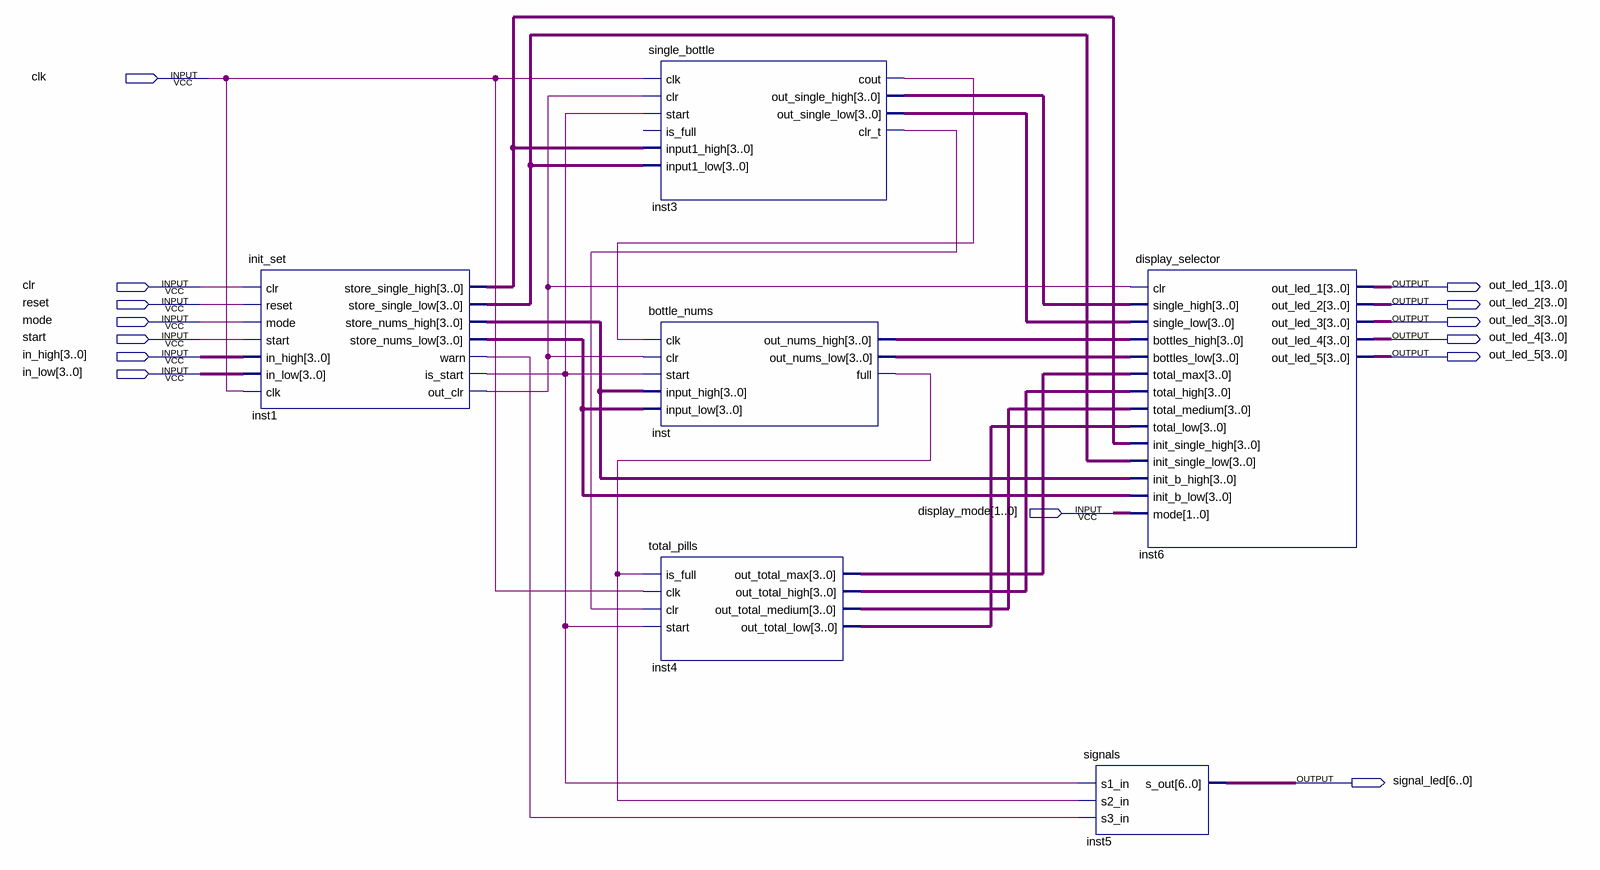
[diagram p0: schematic sheet]
// Quartus schematic pill_bottle.bdf as structural Verilog: 6 symbols, 14 pins
module pill_bottle (
  input  clk,
  input  clr,
  input  reset,
  input  mode,
  input  start,
  input  [3:0] in_high,
  input  [3:0] in_low,
  input  [1:0] display_mode,
  output [3:0] out_led_1,
  output [3:0] out_led_2,
  output [3:0] out_led_3,
  output [3:0] out_led_4,
  output [3:0] out_led_5,
  output [6:0] signal_led
);

  wire inst1_is_start, inst1_out_clr, inst1_warn, inst3_clr_t, inst3_cout, inst_full;
  wire [3:0] inst1_store_nums_high, inst1_store_nums_low, inst1_store_single_high, inst1_store_single_low,
       inst3_out_single_high, inst3_out_single_low, inst4_out_total_high, inst4_out_total_low,
       inst4_out_total_max, inst4_out_total_medium, inst_out_nums_high, inst_out_nums_low;

  init_set inst1 (
    .clr(clr), .reset(reset), .mode(mode), .start(start), .in_high(in_high), .in_low(in_low), .clk(clk),
    .store_single_high(inst1_store_single_high), .store_single_low(inst1_store_single_low),
    .store_nums_high(inst1_store_nums_high), .store_nums_low(inst1_store_nums_low), .warn(inst1_warn),
    .is_start(inst1_is_start), .out_clr(inst1_out_clr));
  single_bottle inst3 (
    .clk(clk), .clr(inst1_out_clr), .start(inst1_is_start), .input1_high(inst1_store_single_high),
    .input1_low(inst1_store_single_low), .cout(inst3_cout), .out_single_high(inst3_out_single_high),
    .out_single_low(inst3_out_single_low), .clr_t(inst3_clr_t));  // open: is_full
  bottle_nums inst (
    .clk(inst3_cout), .clr(inst1_out_clr), .start(inst1_is_start), .input_high(inst1_store_nums_high),
    .input_low(inst1_store_nums_low), .out_nums_high(inst_out_nums_high), .out_nums_low(inst_out_nums_low),
    .full(inst_full));
  total_pills inst4 (
    .is_full(inst_full), .clk(clk), .clr(inst3_clr_t), .start(inst1_is_start),
    .out_total_max(inst4_out_total_max), .out_total_high(inst4_out_total_high),
    .out_total_medium(inst4_out_total_medium), .out_total_low(inst4_out_total_low));
  signals inst5 (.s1_in(inst1_is_start), .s2_in(inst_full), .s3_in(inst1_warn), .s_out(signal_led));
  display_selector inst6 (
    .clr(inst1_out_clr), .single_high(inst3_out_single_high), .single_low(inst3_out_single_low),
    .bottles_high(inst_out_nums_high), .bottles_low(inst_out_nums_low), .total_max(inst4_out_total_max),
    .total_high(inst4_out_total_high), .total_medium(inst4_out_total_medium),
    .total_low(inst4_out_total_low), .init_single_high(inst1_store_single_high),
    .init_single_low(inst1_store_single_low), .init_b_high(inst1_store_nums_high),
    .init_b_low(inst1_store_nums_low), .mode(display_mode), .out_led_1(out_led_1), .out_led_2(out_led_2),
    .out_led_3(out_led_3), .out_led_4(out_led_4), .out_led_5(out_led_5));
endmodule
